# EAGLE design AST1018 (EAGLE 6.3)
DATABASE: ./../../../../../Components/TinyCircuits_Part_Database.txt
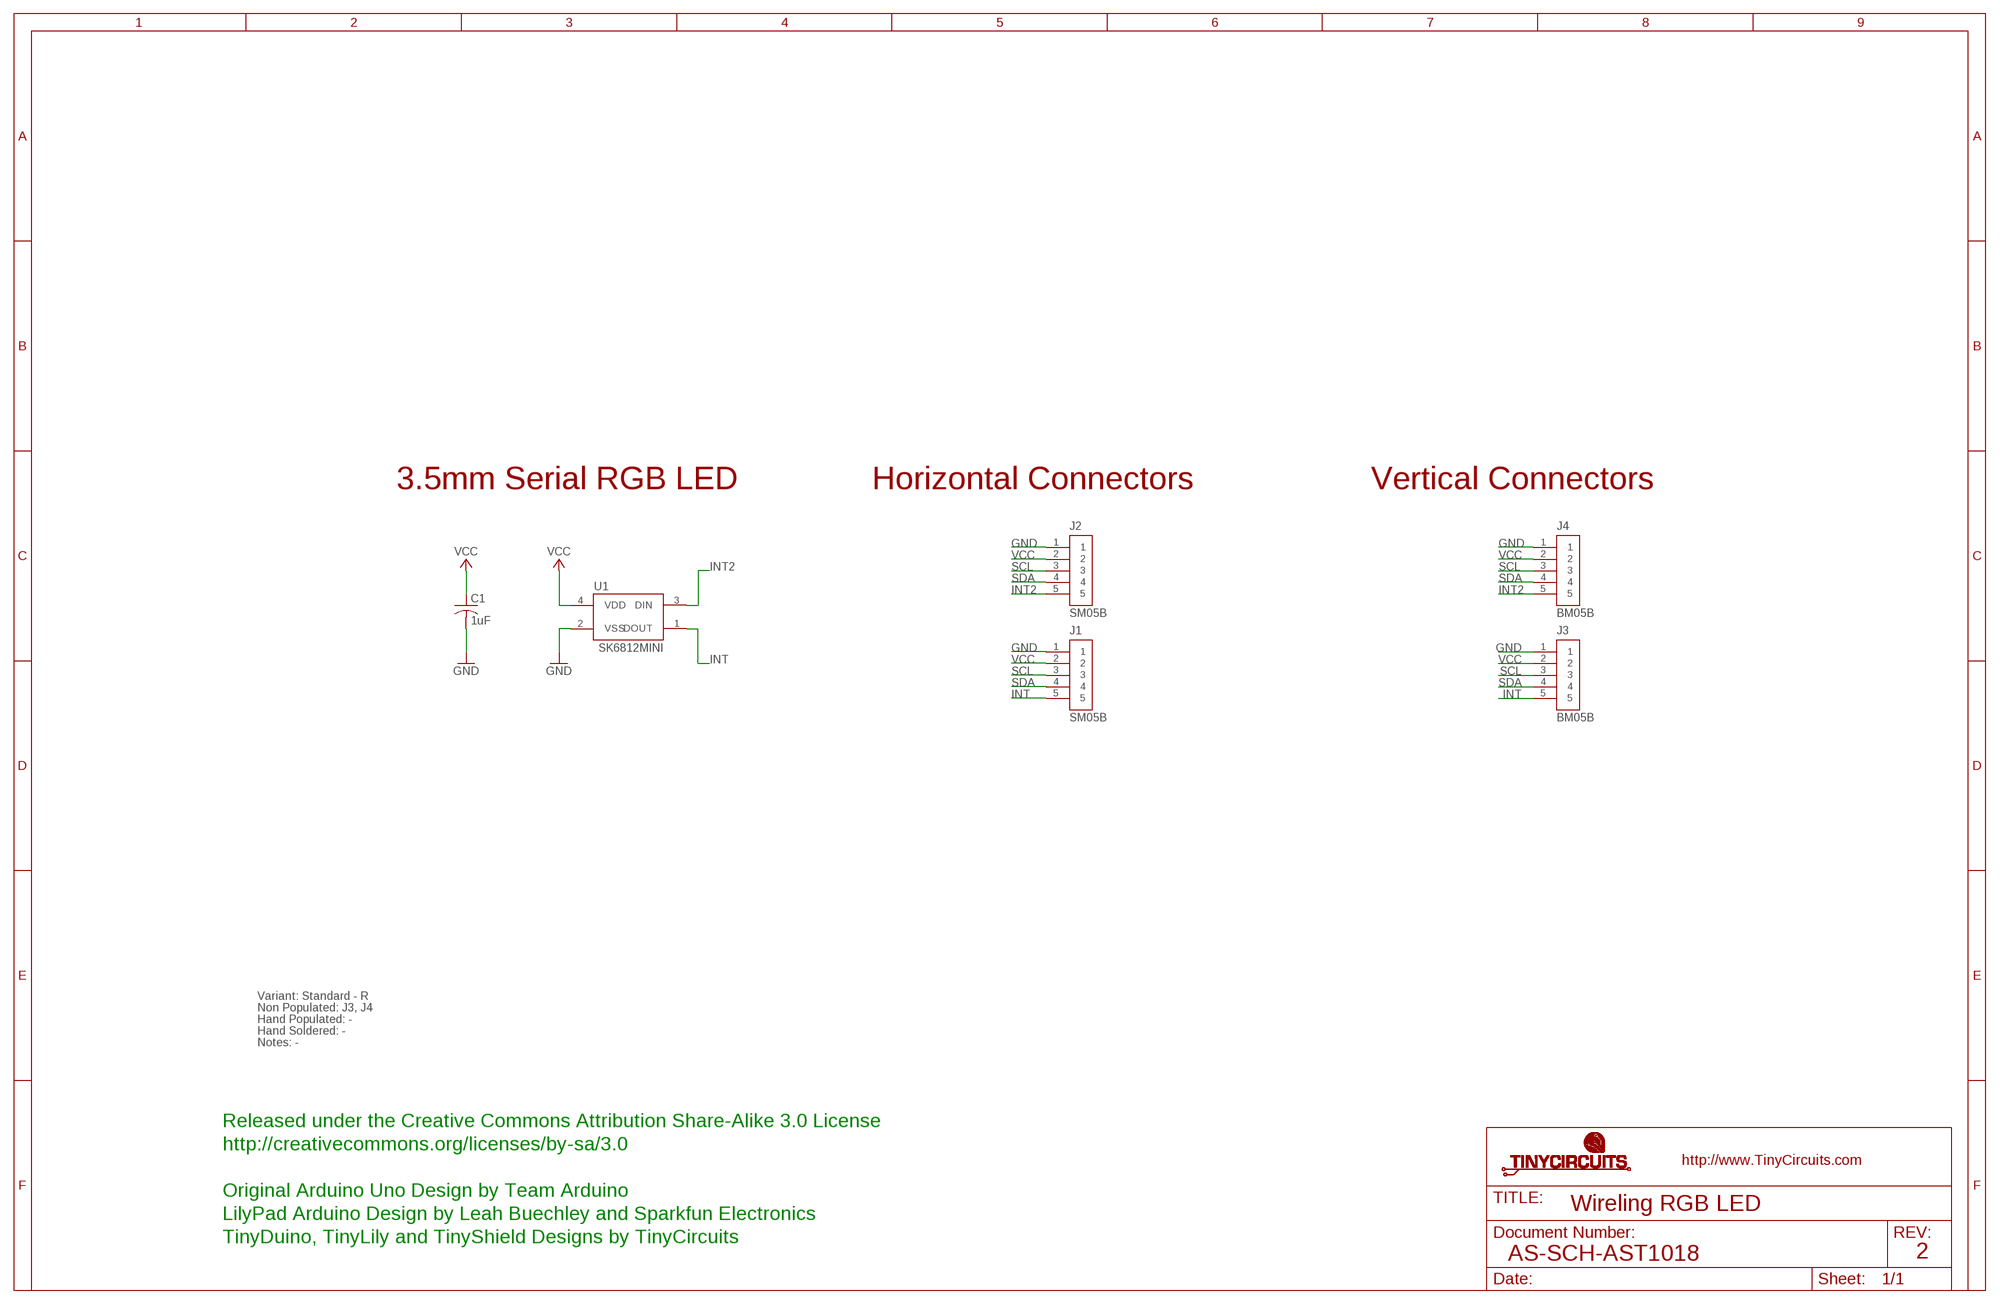
[diagram p0: schematic, sheet 1]

## Parts
C1  1uF  AS-ITM-00410  [C0603]
J1  SM05B  AS-ITM-00340EDGE  [JST_SH_5X1_EDGE]
J2  SM05B  AS-ITM-00340EDGE  [JST_SH_5X1_EDGE]
J3  BM05B  AS-ITM-00391  [JST_SH_5X1_VERT]
J4  BM05B  AS-ITM-00391  [JST_SH_5X1_VERT]
U1  SK6812MINI  AS-ITM-00343  [SK6812MINI]

## Nets
GND: C1.2 J1.1 J2.1 J3.1 J4.1 U1.2(VSS)
INT: J1.5 J3.5 U1.1(DOUT)
INT2: J2.5 J4.5 U1.3(DIN)
SCL: J1.3 J2.3 J3.3 J4.3
SDA: J1.4 J2.4 J3.4 J4.4
VCC: C1.1 J1.2 J2.2 J3.2 J4.2 U1.4(VDD)

## Notes on the sheet
- 3.5mm Serial RGB LED | Horizontal Connectors | Vertical Connectors
- Variant: Standard - R
- Non Populated: J3, J4
- Hand Populated: -
- Hand Soldered: -
- Notes: -
- Released under the Creative Commons Attribution Share-Alike 3.0 License
- http://creativecommons.org/licenses/by-sa/3.0
- Original Arduino Uno Design by Team Arduino
- Wireling RGB LED
- LilyPad Arduino Design by Leah Buechley and Sparkfun Electronics
- TinyDuino, TinyLily and TinyShield Designs by TinyCircuits
- AS-SCH-AST1018 | 2

## Library data of the parts
C1 = tinycircuits:AS-ITM-00410: CAP CER 1UF 10V X5R 0603; PARTNO: AS-ITM-00410
J1 J2 = tinycircuits:AS-ITM-00340: CONN HEADER SH 5POS SIDE 1MM TIN; PARTNO: AS-ITM-00340; PNPROTATION: 180
J3 J4 = tinycircuits:AS-ITM-00391: CONN HEADER SH 5POS TOP 1MM TIN; PARTNO: AS-ITM-00391; PNPROTATION: 0
U1 = tinycircuits:AS-ITM-00343: RGB LED WITH DRIVER MINI 3535; PARTNO: AS-ITM-00343

## Net classes
2 gnd: width 0.305 mm, drill 0.559 mm, clearance 0.254 mm

## Board
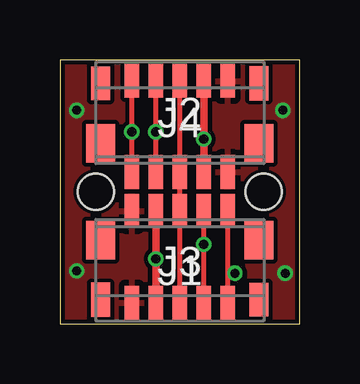
[diagram p1: board, top side]
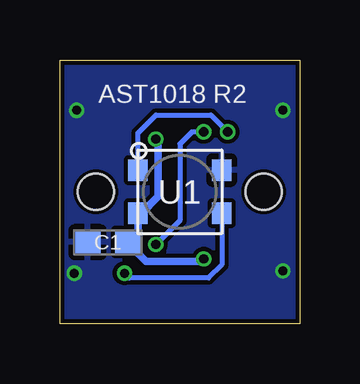
[diagram p2: board, bottom side, seen from below]

Size 10 x 11 mm. Coordinates in mm from the lower left corner, seen from the top.
Outline: 0,0 10,0 10,11 0,11 0,0
Copper layers (1*16): Top 0.035mm / dielectric 1.5mm / Bottom 0.035mm
Design rules "default *": minimum track width 8mil, minimum drill 15mil, track to track 7mil, track to pad 7mil, pad to pad 7mil, via to via 7mil, smd to smd 7mil, copper to edge 7mil, drill to drill 8mil, minimum pad ring 8mil, minimum via ring 5mil, stop-mask expansion 4mil, vias tented up to drill 25mil, thermal gap 10mil
Holes 1.5 mm at 1.5,5.5 8.5,5.5

### Footprints (pad centres in the part's own frame; a part is rotated, then mirrored left to right if it is on the bottom)
C0603 = smd 1.1 x 1: 1 -0.85,0; 2 0.85,0
JST_SH_5X1_EDGE = smd 0.6 x 1.4: 1 -2,2.475; 2 -1,2.475; 3 0,2.475; 4 1,2.475; 5 2,2.475 | smd 0.8 x 1.4: PAD1 -3.3,-1.225; PAD2 3.3,-1.225
JST_SH_5X1_VERT = smd 0.6 x 1.4: 1 -2,-1.725; 2 -1,-1.725; 3 0,-1.725; 4 1,-1.725; 5 2,-1.725 | smd 1.2 x 1.6: PAD1 -3.3,0.875; PAD2 3.3,0.875
SK6812MINI = smd 0.8 x 0.9: 1 -1.75,0.9; 2 -1.75,-0.9; 3 1.75,-0.9; 4 1.75,0.9

### Placement (x,y rotation side)
C1  8,3.4 180 bottom
J1  5,2.22 0 top
J2  5,8.8 180 top
J3  5,2.6 0 top
J4  5,8.4 180 top
U1  5,5.5 180 bottom
U$1  [DOCFIELD-TINYCIRCUITS-PCB]  19,-10 0 top  (outside the outline)

### Tracks (layer width: path | path; a pad name or v marks a point on that pad's centre or on a via)
GND  (via drill 0.38)
  other vias: 0.7,2.2 9.4,2.1 9.3,8.9 0.7,8.9
  pour Bottom: 0,11 10,11 10,0 0,0
  pour Top: 0,11 10,11 10,0 0,0
INT  (via drill 0.38)
  Top 0.203: J3.5 7,2.1 | 7,2.1 J1.5 | v7.3,2.1 7,2.1
  Bottom 0.203: U1.1 3.25,2.45 3.8,1.9 7.1,1.9 v7.3,2.1
INT2  (via drill 0.38)
  Top 0.203: J4.5 v3,8 J2.5
  Bottom 0.203: 3,7.9 v3,8 3.7,8.7 6,8.7 6.75,7.95 U1.3
SCL
  Top 0.203: J1.3 J3.3 J2.3 J4.3
SDA  (via drill 0.38)
  Top 0.203: J3.4 v6,3.3 J1.4 | J4.4 v4,8 J2.4
  Bottom 0.203: v4,8 4.5,8 5,7.5 5,4.3 v6,3.3
VCC  (via drill 0.38)
  Top 0.305: J3.2 v4,2.7 J1.2 | J2.2 v6,7.7 J4.2
  Bottom 0.203: 6.85,4.5 U1.4
  Bottom 0.305: v4,2.7 4.1,2.6 6.4,2.6 7.15,3.35 C1.1 6.75,3.8 U1.4 6.6,4.6 5.9,5.3 5.9,7.6 v6,7.7

### Text on the board
bPlace: AST1018 R2
Document: FABRICATION DRAWING | NOTES: | 1. PRINTED CIRCUIT BOARD MADE FROM NEMA GRADE FR-4 EPOXY LAMINATE | WITH 1 OUNCE COPPER PLATING AND .024 THICKNESS. | 2. ALL DIMENSIONS ARE GIVEN IN MILLIMETERS. | 3. CIRCUIT PATHS ARE FOR REFERENCE ONLY. | 4. HOLE SIZES SHOWN ARE FINISHED DIAMETERS AFTER PLATING. | 5. BOARD PLATED USING REFLOW OR SIMILAR METHOD. | 6. BOARD TO HAVE BLUE SOLDER MASK ON PLATED SURFACES USING WET FILM | 7. SILKSCREEN BOARD USING WHITE INK. | SR100 OR SR1010 EPOXY. EQUIVALENT WET OR DRY FILM MAY BE USED. | 8. THE FOLLOWING INFORMATION APPLIES TO THIS BOARD: | * 2 COPPER LAYERS | * .024 BOARD THICKNESS | * REQUIRES TOP SIDE SILKSCREEN | Released under the Creative Commons Attribution Share-Alike 3.0 License | http://creativecommons.org/licenses/by-sa/3.0 | Original Arduino Uno Design by Team Arduino | LilyPad Arduino Design by Leah Buechley and Sparkfun Electronics | TinyDuino, TinyLily and TinyShield Designs by TinyCircuits | Wireling RGB LED | AS-PCB-AST1018 | 2